# EAGLE schematic Schaltzeichen (EAGLE 7.7.0)
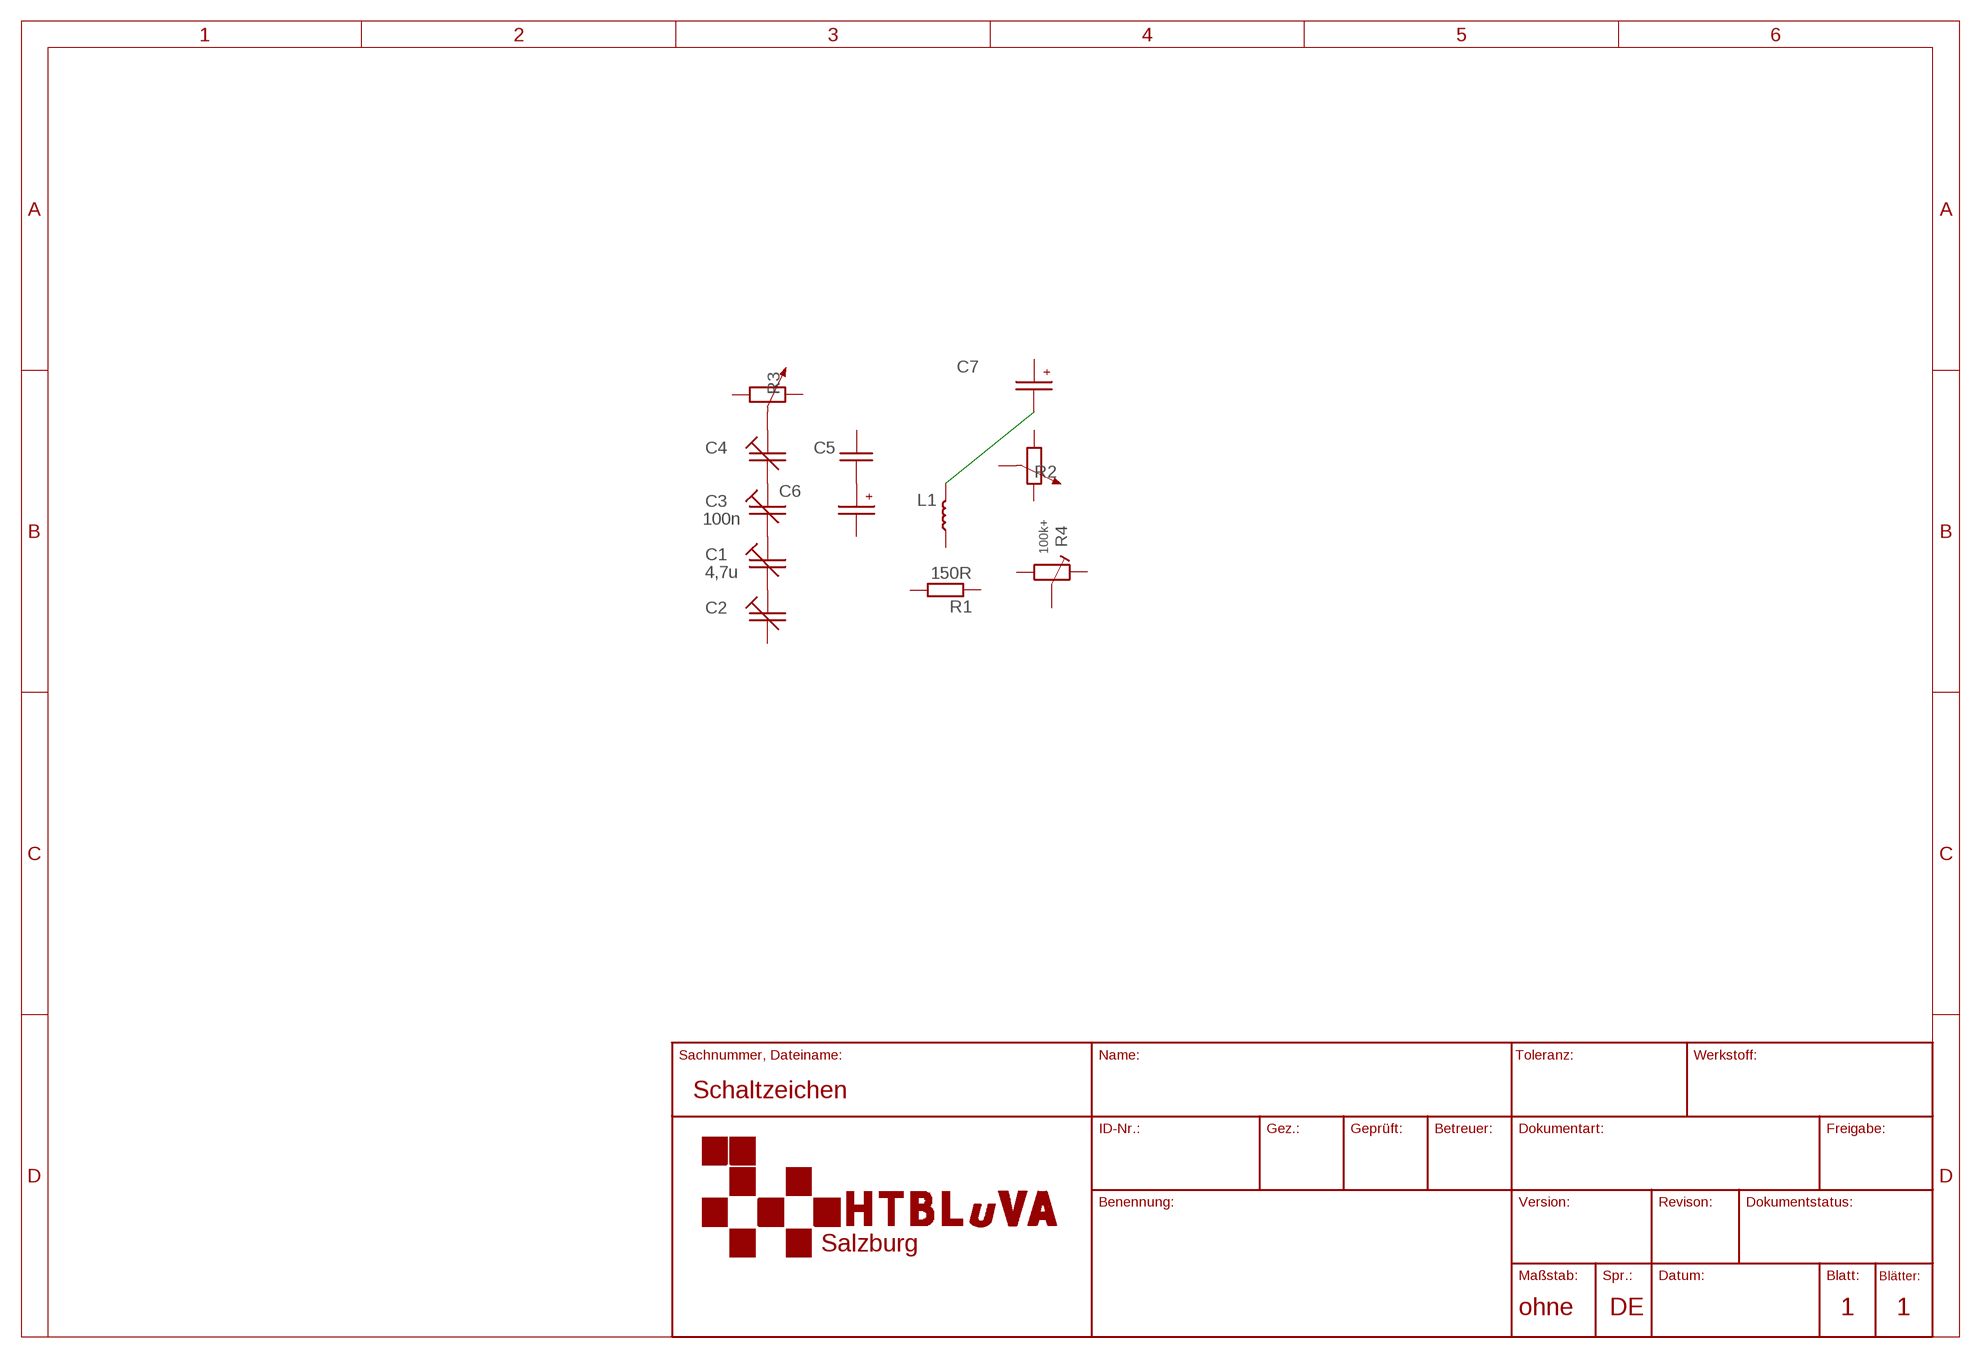
[diagram p0: schematic, sheet 1]

## Parts
C1  4,7u  C-TRIM-V_808-7.5  [CTRIM808-BC7.5]
C2  C-TRIM-V_808-7.5  [CTRIM808-BC7.5]
C3  100n  C-TRIM-V_808-7.5  [CTRIM808-BC7.5]
C4  C-TRIM-V_808-7.5  [CTRIM808-BC7.5]
C5  C-V_025_050-045X075  [C025_050-045X075]
C6  CPOL-V_153CLV-0405  [153CLV-0405]
C7  CPOL-V_153CLV-0405  [153CLV-0405]
L1  L-V_L2012C  [L2012C]
R1  150R  R-H_0613/5V  [P0613V]
R2  R-POT_V_PT-10  [PT-10]
R3  R-POT_V_PT-10  [PT-10]
R4  100k+  R-TRIMM_V_3296P  [RTRIM3296P]

## Nets
N$1: C1.2(A) C2.1(E)
N$2: C1.1(E) C3.2(A)
N$3: C3.1(E) C4.2(A)
N$4: C5.2 C6.+
N$5: C7.- L1.1
N$6: C4.1(E) R3.3
Unconnected: C2.2(A) C5.1 C6.- C7.+ L1.2 R1.1 R1.2 R2.1 R2.2 R2.3 R3.1 R3.2 R4.1(A) R4.2(S) R4.3(E)

## Library data of the parts
C1-C4 = rcl_TicA:C-TRIM-V_: Trimm capacitor
C5 = rcl_TicA:C-V_: CAPACITOR, European symbol
C6 C7 = rcl_TicA:CPOL-V_: POLARIZED CAPACITOR, European symbol
L1 = rcl_TicA:L-V_: INDUCTOR, European symbol
R1 = rcl_TicA:R-H_: RESISTOR, European symbol
R2 R3 = rcl_TicA:R-POT_V_: Potentiometer
R4 = rcl_TicA:R-TRIMM_V_: HTL